# EAGLE board ESP32- 3.5 TFT Display(SPI)V1.0_20230116 (EAGLE 9.6.2), part 1 of 2
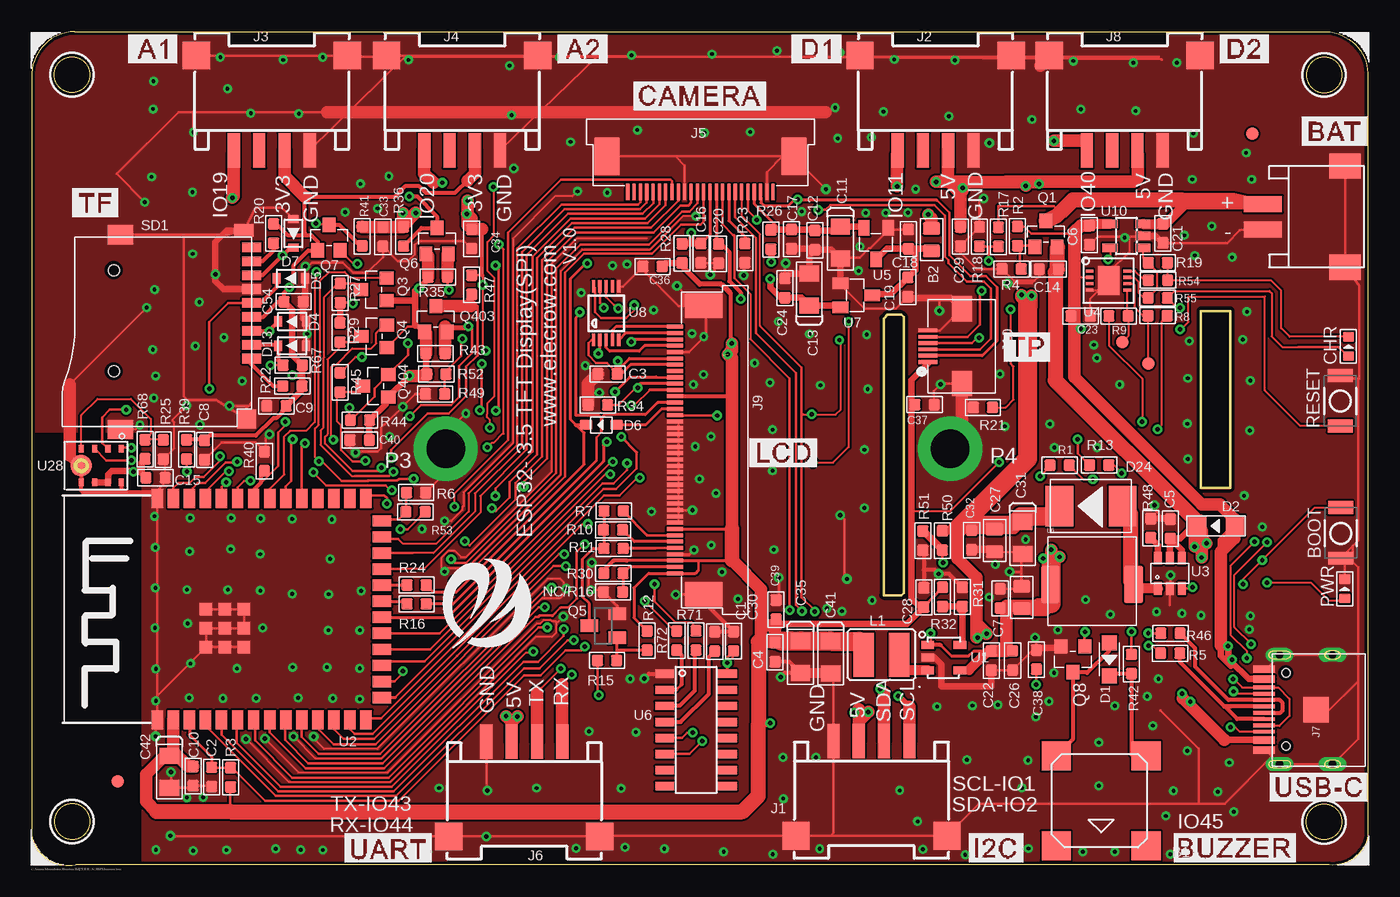
[diagram p5: board, top side]
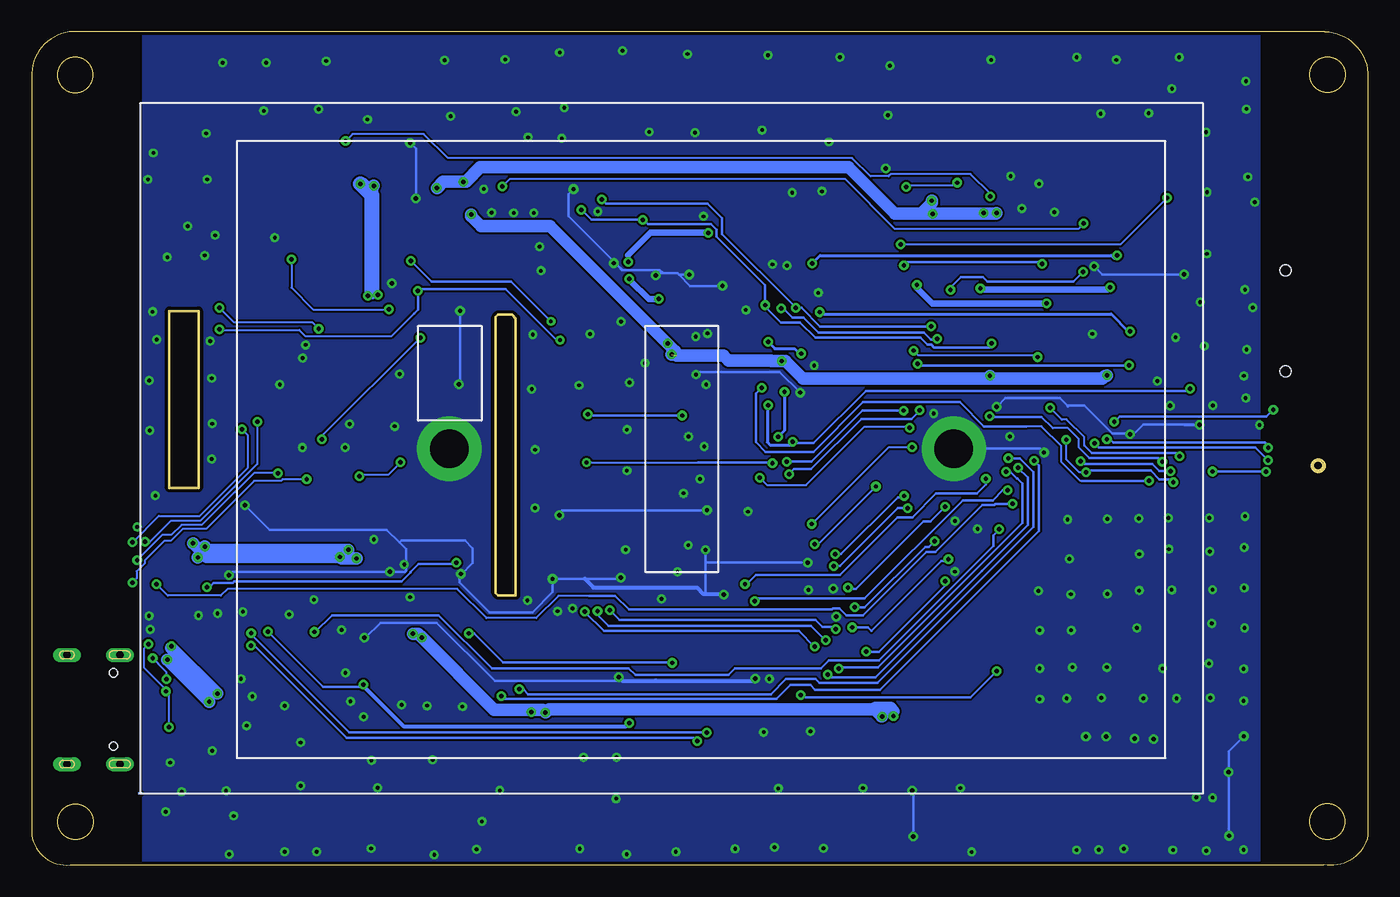
[diagram p6: board, bottom side, seen from below]

Size 105.7 x 65.96 mm. Coordinates in mm from the lower left corner, seen from the top.
Outline: 3.39,65.96 102.4,65.96 arc-90 105.7,62.36 105.7,2.36 arc-90 102.4,0.06 3.5,0.06 arc-90 0,2.36 0,62.36 arc-90 3.39,65.96
Outline: 67.4,43.26 67.4,21.36 68.8,21.36 69,21.56 69,43.36 68.8,43.56 67.7,43.56 67.4,43.26
Outline: 92.5,43.86 92.5,29.86 94.8,29.86 94.8,43.86 92.5,43.86
Outline: circle at 3.19,62.55 radius 1.4
Outline: circle at 3.21,3.46 radius 1.4
Outline: circle at 102.24,3.44 radius 1.4
Outline: circle at 102.25,62.52 radius 1.4
Outline: circle at 3.94,31.59 radius 0.4
Outline: circle at 3.91,31.61 radius 0.51
Copper layers (1*16): Top 0.035mm / dielectric 1.5mm / Bottom 0.035mm
Design rules "default *": minimum track width 6mil, minimum drill 0.3mm, track to track 6mil, track to pad 6mil, pad to pad 6mil, via to via 6mil, smd to smd 6mil, copper to edge 10mil, drill to drill 10mil, minimum pad ring 10mil, minimum via ring 8mil, stop-mask expansion 4mil, vias tented up to drill 20mil, thermal gap 10mil
Net classes: 0 default: width 0.152 mm, drill 0.152 mm, clearance 0.152 mm

## Footprints (pad centres in the part's own frame; a part is rotated, then mirrored left to right if it is on the bottom)
MLT-8530 = smd 2.3 x 2.3: 1 -3.55,3.55; 2 -3.55,-3.55; 3 3.55,-3.55; 4 3.55,3.55
0805@1 = smd 1.016 x 1.397: 1 -0.889,0; 2 0.889,0
2P-2.0-M = smd 1.27 x 3: 1 -1,-0.5; 2 1,-0.5 | smd 2 x 2.5: 3 -4,6; 4 4,6
0603 = smd 0.889 x 0.889: 1 -0.762,0; 2 0.762,0
C0603 = smd 0.889 x 0.889: 1 -0.762,0; 2 0.762,0
1206 = smd 1.27 x 1.524: 1 -1.27,0; 2 1.27,0
0805 = smd 1.016 x 1.397: 1 -0.889,0; 2 0.889,0
DISCRETE_C0603 = smd 0.889 x 0.889: 1 -0.762,0; 2 0.762,0
D0603 = smd 0.762 x 0.889: + -0.762,0; - 0.762,0
SOD-323 = smd 1.2 x 1.2: 1 1.3,0; 2 -1.3,0
1206-1 = smd 1.524 x 1.676: A -1.524,0; C 1.524,0
SOD-323@1 = smd 0.63 x 0.83: 1 -1.115,0; 2 1.115,0
SOD323 = smd 1 x 0.8: + -1.2,0; - 1.2,0
214AB = smd 2.2 x 3.2: 1 -2.5,0; 2 2.5,0
4P-SMD-2.0-90D = smd 0.965 x 2.74: 1 -3,-0.1; 2 -1,-0.1; 3 1,-0.1; 4 3,-0.1 | smd 2.159 x 2.184: SS1 -5.974,7.4; SS2 5.974,7.4
SMD_HEADERP_24PX0.5 = smd 1.3 x 0.3: 1 -3.81,-5.75; 2 -3.81,-5.25; 3 -3.81,-4.75; 4 -3.81,-4.25; 5 -3.81,-3.75; 6 -3.81,-3.25; 7 -3.81,-2.75; 8 -3.81,-2.25; 9 -3.81,-1.75; 10 -3.81,-1.25; 11 -3.81,-0.75; 12 -3.81,-0.25; 13 -3.81,0.25; 14 -3.81,0.75; 15 -3.81,1.25; 16 -3.81,1.75; 17 -3.81,2.25; 18 -3.81,2.75; 19 -3.81,3.25; 20 -3.81,3.75; 21 -3.81,4.25; 22 -3.81,4.75; 23 -3.81,5.25; 24 -3.81,5.75 | smd 3 x 2: 25 -1,-7.4; 26 -1,7.4
KEVIN_3.0TYPEC-SMD = smd 0.3 x 1.7: A1 -3.35,0.5; A4 -2.55,0.5; A5 -1.25,0.5; A6 -0.25,0.5; A7 0.25,0.5; A8 1.25,0.5; A9 2.55,0.5; A12 3.35,0.5; B1 3.05,0.5; B4 2.25,0.5; B5 1.75,0.5; B6 0.75,0.5; B7 -0.75,0.5; B8 -1.75,0.5; B9 -2.25,0.5; B12 -3.05,0.5 | drill 0.6 pad 1.016 long: P$1 -4.325,-0.72; P$2 4.325,-0.72; P$3 -4.325,-4.9; P$4 4.325,-4.9 | smd 2 x 2: P$5 0,-3.597 | hole 0.68: -2.89,-1.22; 2.89,-1.22
SELF_SMD42-50P-2560L490W = smd 0.3 x 1.3: 1 9.75,0; 2 9.25,0; 3 8.75,0; 4 8.25,0; 5 7.75,0; 6 7.25,0; 7 6.75,0; 8 6.25,0; 9 5.75,0; 10 5.25,0; 11 4.75,0; 12 4.25,0; 13 3.75,0; 14 3.25,0; 15 2.75,0; 16 2.25,0; 17 1.75,0; 18 1.25,0; 19 0.75,0; 20 0.25,0; 21 -0.25,0; 22 -0.75,0; 23 -1.25,0; 24 -1.75,0; 25 -2.25,0; 26 -2.75,0; 27 -3.25,0; 28 -3.75,0; 29 -4.25,0; 30 -4.75,0; 31 -5.25,0; 32 -5.75,0; 33 -6.25,0; 34 -6.75,0; 35 -7.25,0; 36 -7.75,0; 37 -8.25,0; 38 -8.75,0; 39 -9.25,0; 40 -9.75,0 | smd 2 x 3: 41 -11.4,-2.25; 42 11.4,-2.25
SMD8-50P-740L535W = smd 0.3 x 1.5: 1 -1.25,0; 2 -0.75,0; 3 -0.25,0; 4 0.25,0; 5 0.75,0; 6 1.25,0 | smd 2 x 1.6: 7 2.95,-2.68; 8 -2.95,-2.68
157SW = smd 1.016 x 1.981: 1 0,0; 2 4,0
CD32 = smd 3.5 x 1.6: 1 0,1.409; 2 0,-1.409
L773 = smd 1.5 x 3: 1 -3.29,-0.254; 2 3.29,-0.254
R0603 = smd 0.889 x 0.889: 1 -0.762,0; 2 0.762,0
PAD-1.0MM = smd 1 x 1: P$1 0,0
3M-5 = drill 3.048 pad 5.08: 1 0,0
LED-0603 = smd 0.762 x 0.889: + -0.762,0; - 0.762,0
DISCRETE_SOT23 = smd 1.016 x 1.143: 1 -0.889,-1.016; 2 0.889,-1.016; 3 0,1.016
SOT23 = smd 1.016 x 1.143: 1 -0.889,-1.016; 2 0.889,-1.016; 3 0,1.016
SPARKFUN_SOT23 = smd 1 x 1.4: 1 -0.95,-1.1; 2 0.95,-1.1; 3 0,1.1
SOT23@1 = smd 1.016 x 1.143: 1 -0.95,-1.016; 2 0.95,-1.016; 3 0,1.016
DISCRETE_R0603 = smd 0.889 x 0.889: 1 -0.762,0; 2 0.762,0
9P-SMD-W/-RING = smd 1.524 x 0.762: 1 0,4.4; 2 0,3.3; 3 0,2.2; 4 0,1.1; 5 0,0; 6 0,-1.1; 7 0,-2.2; 8 0,-3.3; 9 0,-4.4 | smd 1.524 x 1.016: G1 0.6,-5.746 | smd 2.032 x 1.524: G2 10.373,-5.4; G3 10.373,10 | smd 1.524 x 1.524: G4 0.392,9.181 | hole 0.889: 10.9,-2.6; 10.9,5.4
SOT23-5 = smd 1 x 0.635: 1 -1.27,1; 2 -1.27,0; 3 -1.27,-1; 4 1.27,-1; 5 1.27,1
ESP32-S3-WROOM-2-N32R8V/1 = smd 1.5 x 0.9: 1 -8.75,8.255; 2 -8.75,6.985; 3 -8.75,5.715; 4 -8.75,4.445; 5 -8.75,3.175; 6 -8.75,1.905; 7 -8.75,0.635; 8 -8.75,-0.635; 9 -8.75,-1.905; 10 -8.75,-3.175; 11 -8.75,-4.445; 12 -8.75,-5.715; 13 -8.75,-6.985; 14 -8.75,-8.255; 27 8.75,-8.255; 28 8.75,-6.985; 29 8.75,-5.715; 30 8.75,-4.445; 31 8.75,-3.175; 32 8.75,-1.905; 33 8.75,-0.635; 34 8.75,0.635; 35 8.75,1.905; 36 8.75,3.175; 37 8.75,4.445; 38 8.75,5.715; 39 8.75,6.985; 40 8.75,8.255 | smd 0.9 x 1.5: 15 -6.985,-9.505; 16 -5.715,-9.505; 17 -4.445,-9.505; 18 -3.175,-9.505; 19 -1.905,-9.505; 20 -0.635,-9.505; 21 0.635,-9.505; 22 1.905,-9.505; 23 3.175,-9.505; 24 4.445,-9.505; 25 5.715,-9.505; 26 6.985,-9.505 | smd 1 x 1: 41 -1.5,2.9; 42 0,2.9; 43 -3,2.9; 44 -3,1.4; 45 -1.5,1.4; 46 0,1.4; 47 0,4.4; 48 -1.5,4.4; 49 -3,4.4
A_XBJ_SOT23-6 = smd 0.6 x 1: 1 -0.95,-1.2; 2 0,-1.2; 3 0.95,-1.2; 4 0.95,1.2; 5 0,1.2; 6 -0.95,1.2
DFN8 = smd 0.61 x 0.25: 1 -1.5,0.75; 2 -1.5,0.25; 3 -1.5,-0.25; 4 -1.5,-0.75; 5 1.5,-0.75; 6 1.5,-0.25; 7 1.5,0.25; 8 1.5,0.75 | smd 1.7 x 2.3: P$9 0,0
SOT-23 = smd 0.9 x 1.25: 1 -0.95,-1.25; 2 0.95,-1.25; 3 0,1.25
SOP-16 = smd 0.66 x 1.5: 1 -4.445,-2.475; 2 -3.175,-2.475; 3 -1.905,-2.475; 4 -0.635,-2.475; 5 0.635,-2.475; 6 1.905,-2.475; 7 3.175,-2.475; 8 4.445,-2.475; 9 4.445,2.475; 10 3.175,2.475; 11 1.905,2.475; 12 0.635,2.475; 13 -0.635,2.475; 14 -1.905,2.475; 15 -3.175,2.475; 16 -4.445,2.475
MSOP10 = smd 0.25 x 1: 1 -1,-2.113; 2 -0.5,-2.113; 3 0,-2.113; 4 0.5,-2.113; 5 1,-2.113; 6 1,2.113; 7 0.5,2.113; 8 0,2.113; 9 -0.5,2.113; 10 -1,2.113
HX4054A_SOT23_5 = smd 1.2 x 0.69: 1 1.3,-0.95; 2 1.3,0; 3 1.3,0.95; 4 -1.3,0.95; 5 -1.3,-0.95
IIS_INMP441 = smd 0.6 x 0.4: 1 1.203,-0.991; 2 1.203,0.059; 3 1.203,1.109; 4 1.203,2.159; 6 -1.457,2.159; 7 -1.457,1.109; 8 -1.457,0.059; 9 -1.457,-0.991 | smd 1.7 x 1.7: 5 -0.127,2.159
LCD3.5寸 = smd 0.305 x 0.152: P$1 0,0

## Placement (x,y rotation side)
B1  MLT-8530  [MLT-8530]  84.6,5.11 270 top
B2  100MH/600R  [0805@1]  71.18,49.49 90 top
BAT  CON-80-2P-M  [2P-2.0-M]  97.9,51.31 270 top
C1  100nF  [0603]  54.04,17.71 270 top
C2  1uF  [C0603]  14.25,6.99 90 top
C3  100nF  [C0603]  45.55,38.88 180 top
C4  4.7uF  [0603]  58.8,16.86 270 top
C5  22uF  [0603]  90.06,26.62 90 top
C6  10uF  [C0603]  83.69,49.86 90 top
C7  10uF  [0603]  76.61,21.11 90 top
C8  100nF  [C0603]  13.68,32.86 90 top
C9  100nF  [C0603]  19.37,36.34 0 top
C10  100nF  [C0603]  12.77,7.06 90 top
C11  47UF  [1206]  63.97,49.25 90 top
C12  1uF  [0603]  61.95,49.46 270 top
C13  47UF  [1206]  61.52,45.55 270 top
C14  0.01uF  [0603]  80.46,47.17 180 top
C15  100nF  [C0603]  9.81,30.67 180 top
C16  100nF  [C0603]  52.94,48.43 270 top
C17  1nF  [C0603]  60.11,49.55 270 top
C18  10UF  [C0603]  69.34,49.55 270 top
C19  10UF  [C0603]  69.31,45.75 90 top
C20  100nF  [C0603]  54.35,48.39 270 top
C21  1uF  [C0603]  89.48,50 90 top
C22  1uF  [0603]  75.91,16.2 90 top
C23  10uF  [C0603]  82.98,43.46 180 top
C24  0.01uF  [0603]  59.59,45.66 90 top
C26  100nF  [0603]  77.6,16.2 270 top
C27  100uF  [0805]  76.17,25.7 90 top
C28  10nF  [0603]  70.58,21.2 90 top
C29  100nF  [0603]  73.47,49.74 90 top
C30  10UF  [C0603]  55.53,17.73 270 top
C31  47UF  [1206]  78.39,25.89 90 top
C32  0.001uF  [0603]  74.36,25.73 270 top
C33  1uF  [0603]  27.79,49.73 270 top
C34  0.01uF  [0603]  34.82,49.55 270 top
C35  47UF  [1206]  60.82,16.49 90 top
C36  0.001uF  [0603]  49.12,47.38 180 top
C37  1uF  [DISCRETE_C0603]  70.63,36.44 180 top
C38  100nF  [DISCRETE_C0603]  79.49,16.27 270 top
C39  1uF  [0603]  58.88,20.23 90 top
C40  0.01uF  [0603]  25.95,33.64 180 top
C41  47UF  [1206]  63.21,16.45 90 top
C42  47UF  [1206]  10.9,7.4 90 top
C43  22uF  [0805]  78.31,21.19 270 top
C54  4.7uF  [DISCRETE_C0603]  20.72,44.58 180 top
CHR  R  [D0603]  104.16,41.05 90 top
D1  1N5819WS  [SOD-323]  85.25,16.29 270 top
D2  1N5819/S0D-123  [1206-1]  93.68,26.86 180 top
D4  BZT52C3V3S  [SOD-323@1]  20.62,43.02 0 top
D5  BZT52C3V3S  [SOD-323@1]  20.51,46.43 0 top
D6  1N4148WS  [SOD323]  45.07,34.85 180 top
D7  BZT52C3V3S  [SOD-323@1]  20.72,50 90 top
D13  BZT52C3V3S  [SOD-323@1]  20.61,41.1 0 top
D24  SS34B/SMB  [214AB]  83.8,28.43 180 top
J1  [4P-SMD-2.0-90D]  66.43,9.74 180 top
J2  [4P-SMD-2.0-90D]  71.5,56.66 0 top
J3  [4P-SMD-2.0-90D]  19,56.66 0 top
J4  [4P-SMD-2.0-90D]  34.06,56.66 0 top
J5  SMD_HEADERP_24PX0.5上接  [SMD_HEADERP_24PX0.5]  52.91,57.09 90 top
J6  [4P-SMD-2.0-90D]  38.97,9.69 180 top
J7  KEVIN_TYPEC-3.0-16P-SMD  [KEVIN_3.0TYPEC-SMD]  98,12.32 90 top
J8  [4P-SMD-2.0-90D]  86.46,56.66 0 top
J9  SELF_FPC-40P上接  [SELF_SMD42-50P-2560L490W]  50.9,32.86 90 top
J10  AFC01-S06FCC-00下接  [SMD8-50P-740L535W]  70.9,41.07 90 top
K1  BUTTON  [157SW]  103.51,38.76 270 top
K2  BUTTON  [157SW]  103.55,28.3 270 top
L1  CD32_10uH  [CD32]  67.22,16.65 270 top
L6  33UH  [L773]  83.88,22.47 0 top
NC/R16  0R  [R0603]  45.98,21.63 0 top
P1  PADPAD-1.0MM  [PAD-1.0MM]  96.55,57.88 0 top
P3  3M-5  [3M-5]  32.75,32.96 0 top
P4  3M-5  [3M-5]  72.65,32.96 0 top
P5  PADPAD-1.0MM  [PAD-1.0MM]  6.81,6.65 0 top
P11  PADPAD-1.0MM  [PAD-1.0MM]  86.27,41.41 0 top
P12  PADPAD-1.0MM  [PAD-1.0MM]  88.34,39.69 0 top
PWR  G  [LED-0603]  103.86,21.87 90 top
Q1  SI2301_P  [DISCRETE_SOT23]  80.23,49.95 0 top
Q3  [SOT23]  27.06,45.56 90 top
Q4  [SOT23]  27.09,41.85 90 top
Q5  S8050  [SPARKFUN_SOT23]  45.22,18.96 90 top
Q6  [SOT23]  32.07,49.4 0 top
Q7  [SOT23]  23.53,49.65 0 top
Q8  S9013  [SOT23@1]  82.36,16.31 180 top
Q403  [SOT23]  31.97,43.23 0 top
Q404  [SOT23]  27.2,37.93 90 top
R1  1K  [R0603]  81.31,31.65 180 top
R2  100R  [R0603]  77.98,49.78 90 top
R3  10k  [R0603]  15.73,6.96 270 top
R4  51K  [R0603]  77.52,47.18 180 top
R5  22R  [DISCRETE_R0603]  90.06,16.78 180 top
R6  10k  [R0603]  30.41,29.48 180 top
R7  33R  [R0603]  46.04,28.03 0 top
R8  0R  [R0603]  89.07,43.48 180 top
R9  0R  [R0603]  85.97,43.47 0 top
R10  33R  [R0603]  45.99,26.54 0 top
R11  33R  [R0603]  46.03,25.07 0 top
R12  10k/NC  [R0603]  48.69,17.77 90 top
R13  0R  [DISCRETE_R0603]  84.43,31.66 0 top
R15  100R  [R0603]  45.52,16.2 180 top
R16  0R  [R0603]  30.45,20.68 180 top
R17  1M  [R0603]  76.47,49.72 270 top
R18  1M  [R0603]  74.97,49.74 90 top
R19  NC  [R0603]  89.09,47.68 180 top
R20  10K  [DISCRETE_R0603]  19.13,49.98 270 top
R21  2k  [R0603]  75.25,36.23 180 top
R22  10K  [DISCRETE_R0603]  20.63,37.92 180 top
R23  10K  [DISCRETE_R0603]  56.42,48.44 90 top
R24  0R  [R0603]  30.45,22.18 180 top
R25  0R  [R0603]  10.42,32.89 270 top
R26  NC/0R  [R0603]  58.48,49.51 90 top
R27  4.7K  [R0603]  24.41,45.28 90 top
R28  0R  [R0603]  51.45,48.42 270 top
R29  4.7K  [R0603]  24.39,42.16 270 top
R30  0R  [R0603]  46.02,23.1 0 top
R31  24K 1%  [R0603]  73.62,21.24 270 top
R32  110K 1%  [R0603]  72.06,21.23 90 top
R34  10K  [DISCRETE_R0603]  44.79,36.42 0 top
R35  4.7k  [R0603]  32.12,46.54 180 top
R36  4.7K  [R0603]  29.41,49.75 270 top
R39  0R  [R0603]  12.26,32.91 90 top
R40  4.7K  [DISCRETE_R0603]  18.41,31.97 90 top
R41  4.7K  [R0603]  26.15,49.77 270 top
R42  5.1R  [R0603]  87.01,15.93 270 top
R43  4.7k  [DISCRETE_R0603]  31.95,40.5 180 top
R44  4.7K  [DISCRETE_R0603]  25.98,35.22 0 top
R45  4.7K  [R0603]  24.39,38.2 270 top
R46  22R  [DISCRETE_R0603]  90.08,18.36 180 top
R47  4.7K  [R0603]  34.81,45.92 270 top
R48  20K  [DISCRETE_R0603]  88.52,26.67 270 top
R49  0R  [DISCRETE_R0603]  31.92,37.29 0 top
R50  73.2K 1%  [DISCRETE_R0603]  72.04,25.7 270 top
R51  10K  [DISCRETE_R0603]  70.49,25.68 270 top
R52  NC  [DISCRETE_R0603]  32.02,38.85 180 top
R53  1K  [DISCRETE_R0603]  30.37,27.97 0 top
R54  5.1K  [DISCRETE_R0603]  89.09,46.29 180 top
R55  5.1K  [DISCRETE_R0603]  89.08,44.89 180 top
R67  10K  [DISCRETE_R0603]  20.65,39.58 180 top
R68  NC/0R  [R0603]  8.98,32.92 270 top
R71  22R  [DISCRETE_R0603]  52.55,17.79 270 top
R72  470R  [DISCRETE_R0603]  51.03,17.77 270 top
SD1  [9P-SMD-W/-RING]  17.4,44.49 180 top
U1  HX3406  [SOT23-5]  72.16,16.44 0 top
U2  ESP32-S3-WROOM-2-N32R8V/1  [ESP32-S3-WROOM-2-N32R8V/1]  18.2,20.26 90 top
U3  HM1548C  [A_XBJ_SOT23-6]  90.04,23.1 0 top
U4  STC8G1K08  [DFN8]  85.18,46.27 0 top
U5  XC6206  [SOT-23]  66.79,49.19 180 top
U6  CH340C  [SOP-16]  52.56,10.71 270 top
U7  XC6206  [SOT-23]  65.24,45.1 270 top
U8  NS2009  [MSOP10]  45.45,43.68 0 top
U10  HX4054A  [HX4054A_SOT23_5]  86.61,49.8 0 top
U28  IIS_INMP441  [IIS_INMP441]  6.1,31.76 90 top
U$24  [ESP32-SPI2]  -14.68,-16.87 0 top  (outside the outline)
U$42  [LOGO]  36.23,20.46 90 top
U$44  [TOP-SMT-ESP32]  -0.02,0.03 0 top
U$63  TFT-3.5  [LCD3.5寸]  97.12,5.69 0 bottom